# EAGLE design doska-analog (EAGLE 6.3)
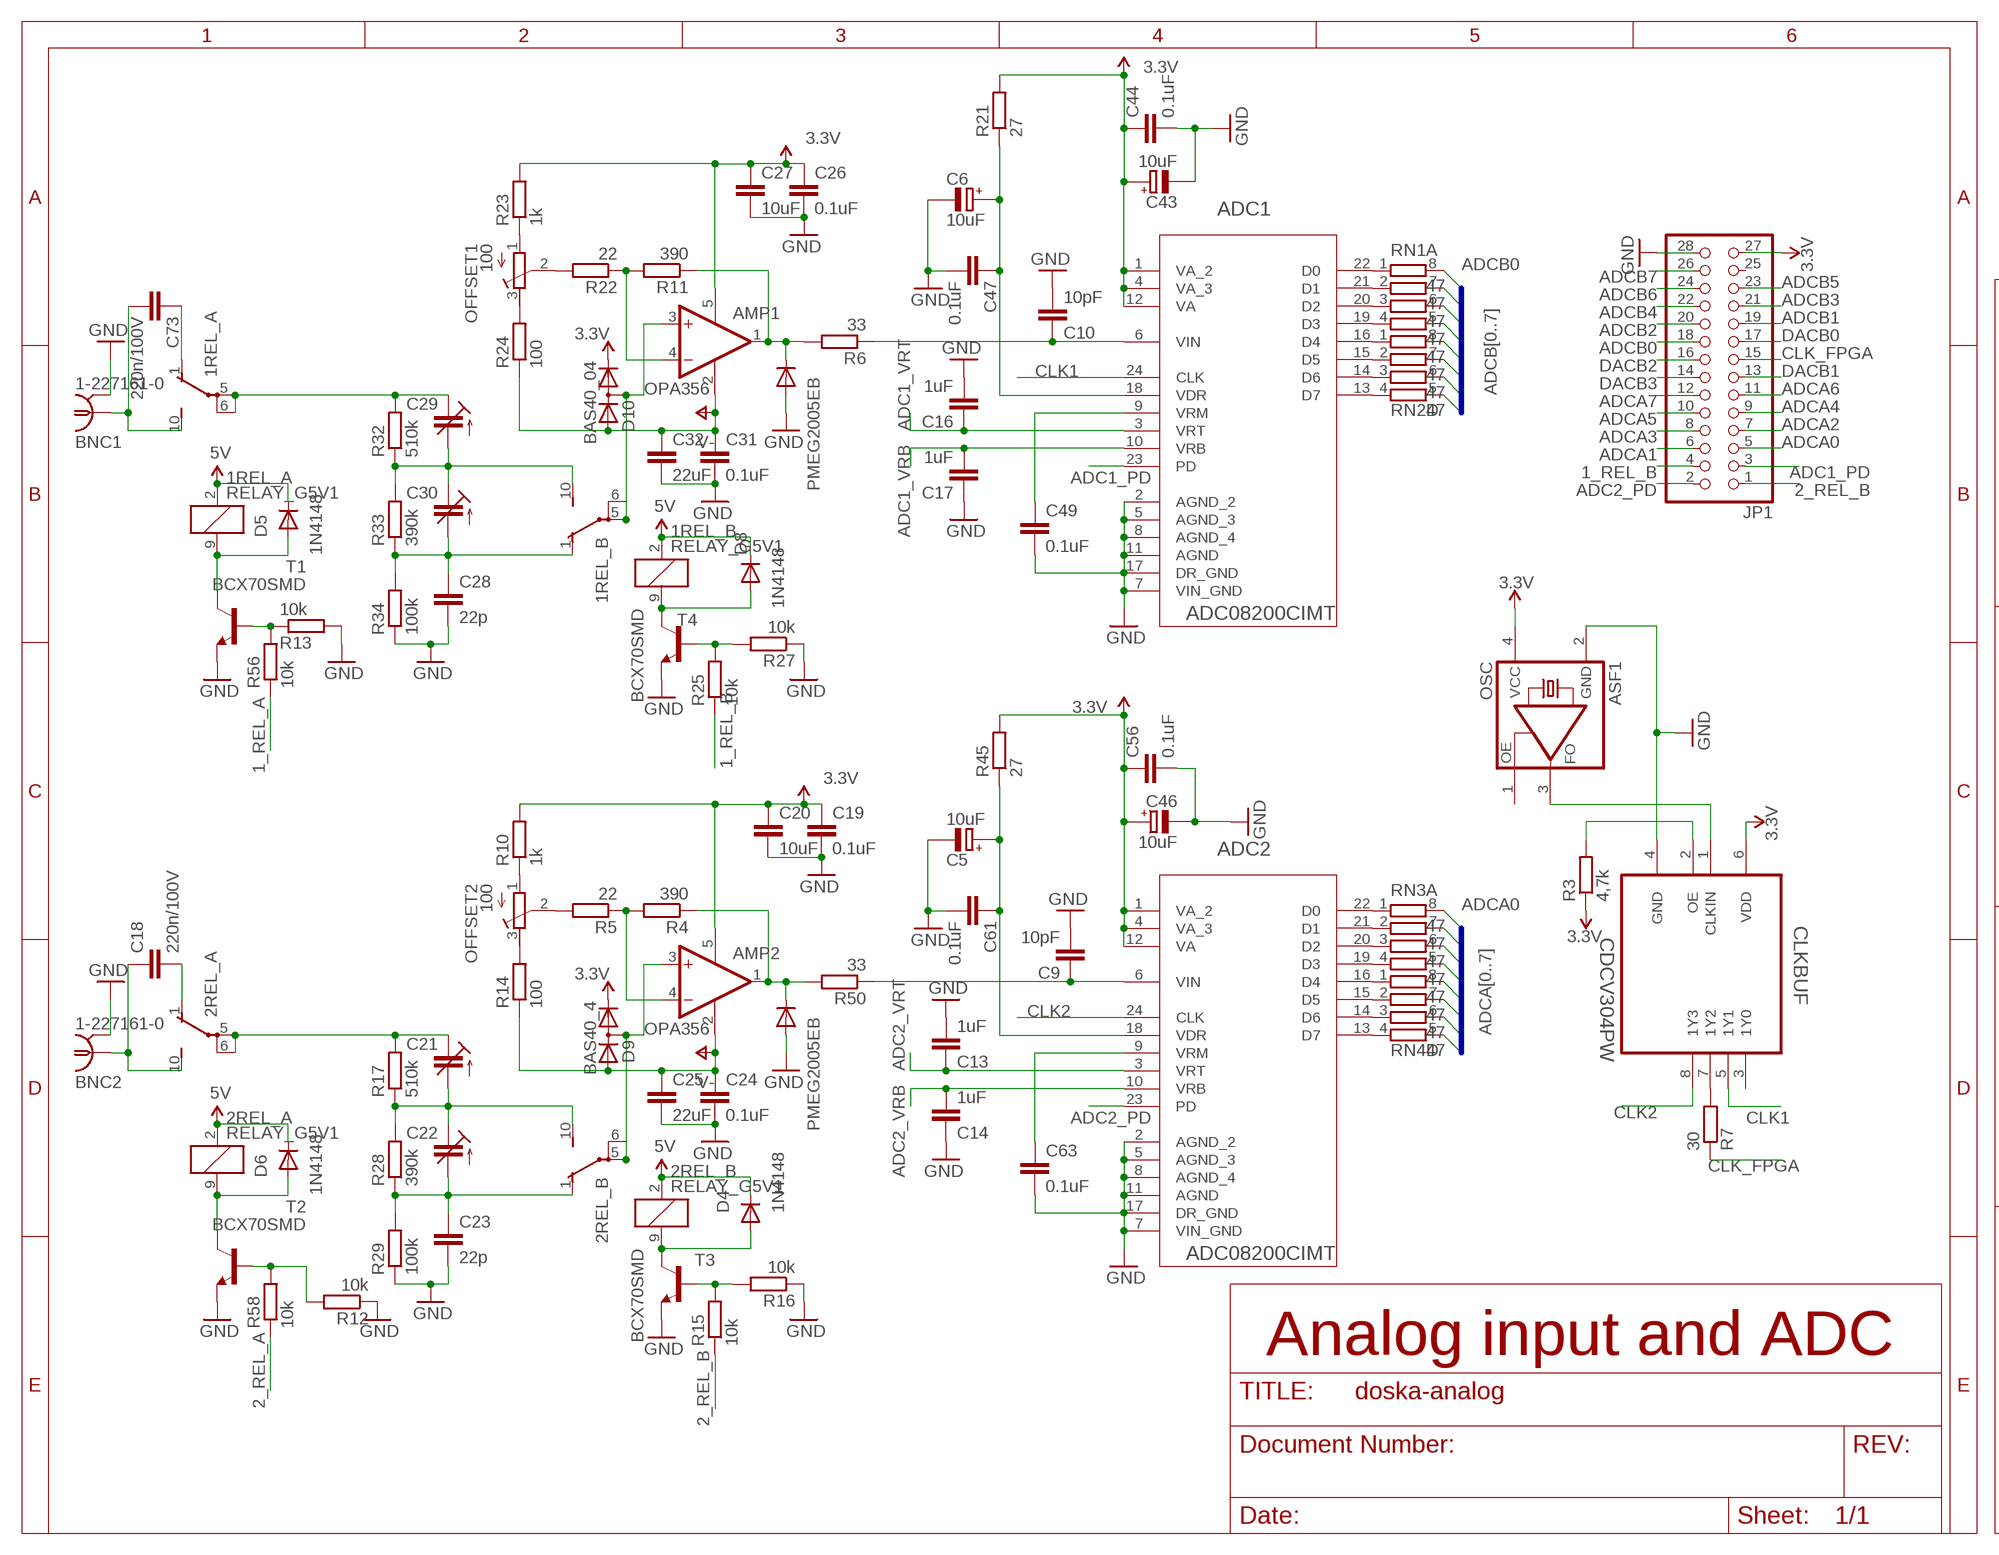
[diagram p0: schematic, sheet 1, part 1 of 2]
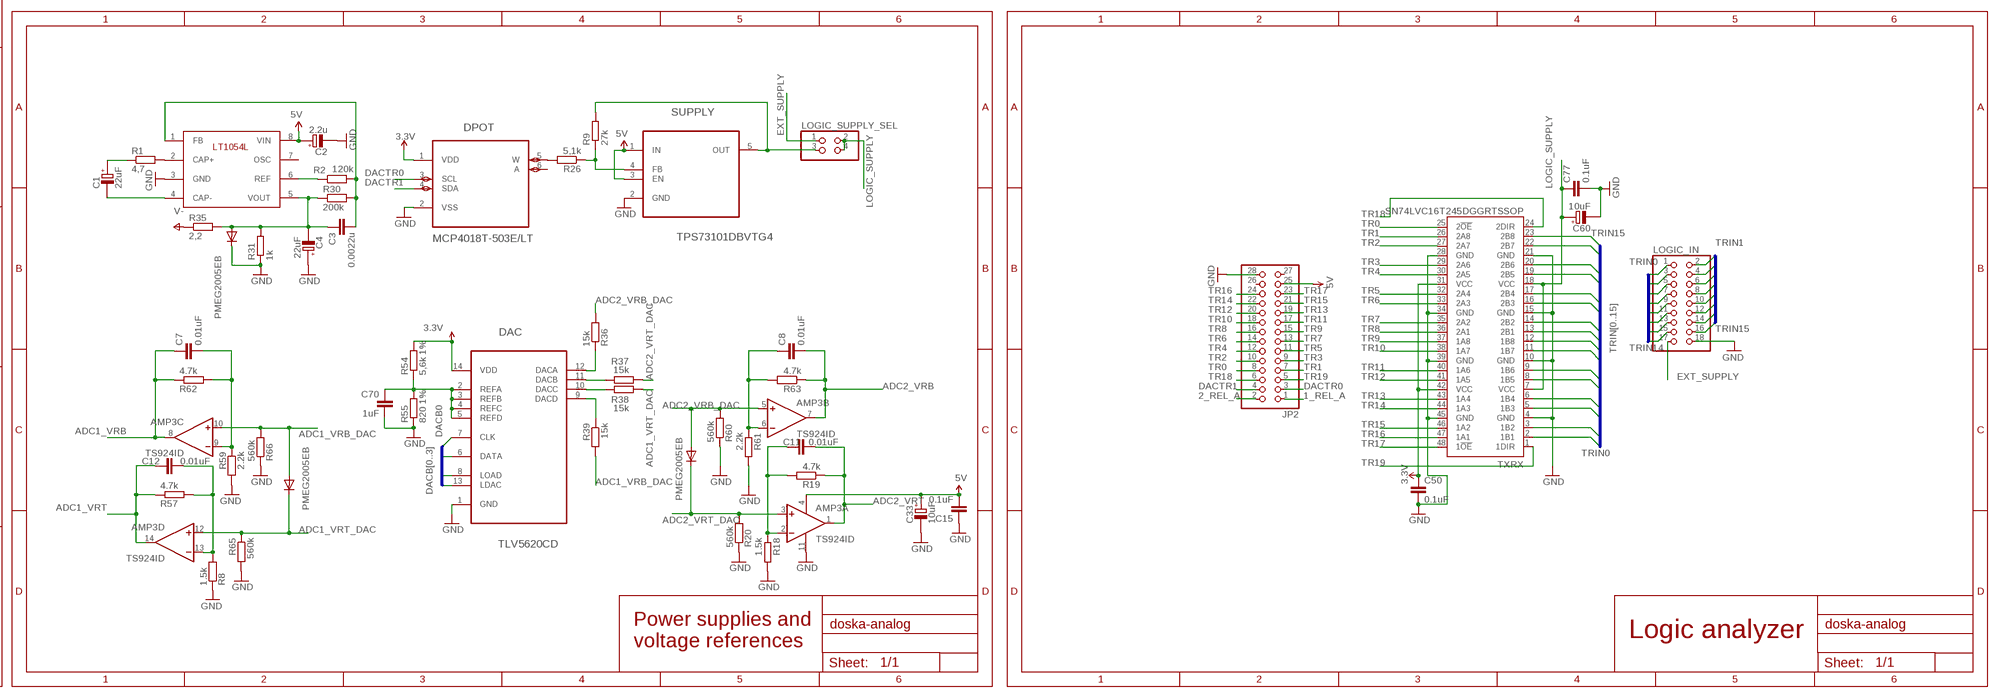
[diagram p1: schematic, sheet 1, part 2 of 2]

## Parts
1REL_A  RELAY_G5V1  [RELAY_G5V1]
1REL_B  RELAY_G5V1  [RELAY_G5V1]
2REL_A  RELAY_G5V1  [RELAY_G5V1]
2REL_B  RELAY_G5V1  [RELAY_G5V1]
ADC1  ADC08200CIMT  [SOP65P640X110-24N]
ADC2  ADC08200CIMT  [SOP65P640X110-24N]
AMP1  OPA356  [SOT23-5]
AMP2  OPA356  [SOT23-5]
AMP3  TS924ID  LM324  [SOIC127P600X175-14N]
BNC1  1-227161-0  [AMP_227161]
BNC2  1-227161-0  [AMP_227161]
C1  22uF  POLARISED_B_CASE  [CAPMP3528X210N]
C2  2.2u  POLARISED_A_CASE  [CAPMP3216X180N]
C3  0.0022u  CAPC603  [C603]
C4  22uF  POLARISED_B_CASE  [CAPMP3528X210N]
C5  10uF  POLARISED_A_CASE  [CAPMP3216X180N]
C6  10uF  POLARISED_A_CASE  [CAPMP3216X180N]
C7  0.01uF  CAPC603  [C603]
C8  0.01uF  CAPC603  [C603]
C9  10pF  CAPC603  [C603]
C10  10pF  CAPC603  [C603]
C11  0.01uF  CAPC603  [C603]
C12  0.01uF  CAPC603  [C603]
C13  1uF  CAPC603  [C603]
C14  1uF  CAPC603  [C603]
C15  0.1uF  CAPC805  [C805]
C16  1uF  CAPC603  [C603]
C17  1uF  CAPC603  [C603]
C18  220n/100V  CAPC1206  [C1206]
C19  0.1uF  CAPC603  [C603]
C20  10uF  CAPC805  [C805]
C21  TZB4Z100AB10R00  C-TRIMMTZB4  [CTRIMTZB4]
C22  TZB4Z100AB10R00  C-TRIMMTZB4  [CTRIMTZB4]
C23  22p  CAPC603  [C603]
C24  0.1uF  CAPC603  [C603]
C25  22uF  CAPC805  [C805]
C26  0.1uF  CAPC603  [C603]
C27  10uF  CAPC805  [C805]
C28  22p  CAPC603  [C603]
C29  TZB4Z100AB10R00  C-TRIMMTZB4  [CTRIMTZB4]
C30  TZB4Z100AB10R00  C-TRIMMTZB4  [CTRIMTZB4]
C31  0.1uF  CAPC603  [C603]
C32  22uF  CAPC805  [C805]
C33  10uF  POLARISED_A_CASE  [CAPMP3216X180N]
C43  10uF  POLARISED_A_CASE  [CAPMP3216X180N]
C44  0.1uF  CAPC603  [C603]
C46  10uF  POLARISED_A_CASE  [CAPMP3216X180N]
C47  0.1uF  CAPC603  [C603]
C49  0.1uF  CAPC603  [C603]
C50  0.1uF  CAPC805  [C805]
C56  0.1uF  CAPC603  [C603]
C60  10uF  POLARISED_A_CASE  [CAPMP3216X180N]
C61  0.1uF  CAPC603  [C603]
C63  0.1uF  CAPC603  [C603]
C70  1uF  CAPC603  [C603]
C73  220n/100V  CAPC1206  [C1206]
C77  0.1uF  CAPC805  [C805]
CLKBUF  CDCV304PW  [SOP65P640X120-8N]
D1  PMEG2005EB  DIODE-SOD523  [SOD523]
D2  PMEG2005EB  DIODE-SOD523  [SOD523]
D3  PMEG2005EB  DIODE-SOD523  [SOD523]
D4  1N4148  DIODE-SOD323-R  [SOD323-R]
D5  1N4148  DIODE-SOD323-R  [SOD323-R]
D6  1N4148  DIODE-SOD323-R  [SOD323-R]
D7  PMEG2005EB  DIODE-SOD523  [SOD523]
D8  1N4148  DIODE-SOD323-R  [SOD323-R]
D9  BAS40_4  DIODE_2CACA-SOT23  [SOT23]
D10  BAS40_04  DIODE_2CACA-SOT23  [SOT23]
D11  PMEG2005EB  DIODE-SOD523  [SOD523]
DAC  TLV5620CD  [SOIC127P600X175-14N]
DPOT  MCP4018T-503E/LT  [SOT65P210X110-6N]
JP1  PINHEAD_PINHD-2X14  [PINHEAD_2X14]
JP2  PINHEAD_PINHD-2X14  [PINHEAD_2X14]
LOGIC_IN  PINHEAD_PINHD-2X9  [PINHEAD_2X09]
LOGIC_SUPPLY_SEL  PINHEAD_PINHD-2X2  [PINHEAD_2X02]
OFFSET1  100  R-TRIMMTC33  [RTRIMTC33]
OFFSET2  100  R-TRIMMTC33  [RTRIMTC33]
OSC  ASF1  [ASF]
R1  4,7  RESISTORR1206  [R1206]
R2  120k  RESISTORR603  [R603]
R3  4,7k  RESISTORR603  [R603]
R4  390  RESISTORR603  [R603]
R5  22  RESISTORR603  [R603]
R6  33  RESISTORR603  [R603]
R7  30  RESISTORR603  [R603]
R8  1.5k  RESISTORR603  [R603]
R9  27k  RESISTORR603  [R603]
R10  1k  RESISTORR603  [R603]
R11  390  RESISTORR603  [R603]
R12  10k  RESISTORR603  [R603]
R13  10k  RESISTORR603  [R603]
R14  100  RESISTORR603  [R603]
R15  10k  RESISTORR603  [R603]
R16  10k  RESISTORR603  [R603]
R17  510k  RESISTORR805R805  [R805]
R18  1.5k  RESISTORR603  [R603]
R19  4.7k  RESISTORR603  [R603]
R20  560k  RESISTORR603  [R603]
R21  27  RESISTORR603  [R603]
R22  22  RESISTORR603  [R603]
R23  1k  RESISTORR603  [R603]
R24  100  RESISTORR603  [R603]
R25  10k  RESISTORR603  [R603]
R26  5,1k  RESISTORR603  [R603]
R27  10k  RESISTORR603  [R603]
R28  390k  RESISTORR805R805  [R805]
R29  100k  RESISTORR805R805  [R805]
R30  200k  RESISTORR603  [R603]
R31  1k  RESISTORR603  [R603]
R32  510k  RESISTORR805R805  [R805]
R33  390k  RESISTORR805R805  [R805]
R34  100k  RESISTORR805R805  [R805]
R35  2,2  RESISTORR603  [R603]
R36  15k  RESISTORR603  [R603]
R37  15k  RESISTORR603  [R603]
R38  15k  RESISTORR603  [R603]
R39  15k  RESISTORR603  [R603]
R45  27  RESISTORR603  [R603]
R50  33  RESISTORR603  [R603]
R54  5,6k 1%  RESISTORR603  [R603]
R55  820 1%  RESISTORR603  [R603]
R56  10k  RESISTORR603  [R603]
R57  4.7k  RESISTORR603  [R603]
R58  10k  RESISTORR603  [R603]
R59  2.2k  RESISTORR603  [R603]
R60  560k  RESISTORR603  [R603]
R61  2.2k  RESISTORR603  [R603]
R62  4.7k  RESISTORR603  [R603]
R63  4.7k  RESISTORR603  [R603]
R65  560k  RESISTORR603  [R603]
R66  560k  RESISTORR603  [R603]
RN1  47  4R-NEXB38V  [EXB38V]
RN2  47  4R-NEXB38V  [EXB38V]
RN3  47  4R-NEXB38V  [EXB38V]
RN4  47  4R-NEXB38V  [EXB38V]
SUPPLY  TPS73101DBVTG4  [SOT95P280X145-5N]
T1  BCX70SMD  [SOT23]
T2  BCX70SMD  [SOT23]
T3  BCX70SMD  [SOT23]
T4  BCX70SMD  [SOT23]
TXRX  SN74LVC16T245DGGRTSSOP  [TSSOP48]
VREG  LT1054LCS8  [SO08]

## Nets
1_REL_A: JP2.1 R56.1
1_REL_B: JP1.4 R25.1
2_REL_A: JP2.2 R58.1
2_REL_B: JP1.1 R15.1
3.3V: ADC1.1(VA_2) ADC1.4(VA_3) ADC1.12(VA) ADC2.1(VA_2) ADC2.4(VA_3) ADC2.12(VA) AMP1.5(V+) AMP2.5(V+) C19.1 C20.1 C26.1 C27.1 C43.+ C44.1 C46.+ C50.1 C56.1 CLKBUF.6(VDD) D9.2(C) D10.2(C) DAC.14(VDD) DPOT.1(VDD) JP1.27 OSC.4(VCC) R3.1 R10.2 R21.2 R23.2 R45.2 R54.2 TXRX.31(VCC) TXRX.42(VCC)
5V: 1REL_A.2 1REL_B.2 2REL_A.2 2REL_B.2 AMP3.4(P:V+) C2.+ C15.2 C33.+ D4.C D5.C D6.C D8.C JP2.25 SUPPLY.1(IN) SUPPLY.3(EN) VREG.8(VIN)
ADC1_PD: ADC1.23(PD) JP1.3
ADC1_VRB: ADC1.10(VRB) AMP3.8(C:OUT) C7.1 C17.2 R62.1
ADC1_VRB_DAC: AMP3.10(C:+IN) D2.A R39.2 R66.2
ADC1_VRB_DAC_OUT: DAC.9(DACD) R39.1
ADC1_VRT: ADC1.3(VRT) AMP3.14(D:OUT) C12.1 C16.1 R57.1
ADC1_VRT_DAC: AMP3.12(D:+IN) D2.C R38.1 R65.1
ADC1_VRT_DAC_OUT: DAC.10(DACC) R38.2
ADC2_PD: ADC2.23(PD) JP1.2
ADC2_VRB: ADC2.10(VRB) AMP3.7(B:OUT) C8.2 C14.2 R63.1
ADC2_VRB_DAC: AMP3.5(B:+IN) D3.A R36.2 R60.2
ADC2_VRB_DAC_OUT: DAC.12(DACA) R36.1
ADC2_VRT: ADC2.3(VRT) AMP3.1(A:OUT) C11.2 C13.1 R19.1
ADC2_VRT_DAC: AMP3.3(A:+IN) D3.C R20.2 R37.1
ADC2_VRT_DAC_OUT: DAC.11(DACB) R37.2
ADCA0: JP1.5 RN3.8
ADCA1: JP1.6 RN3.7
ADCA2: JP1.7 RN3.6
ADCA3: JP1.8 RN3.5
ADCA4: JP1.9 RN4.8
ADCA5: JP1.10 RN4.7
ADCA6: JP1.11 RN4.6
ADCA7: JP1.12 RN4.5
ADCB0: JP1.18 RN1.8
ADCB1: JP1.19 RN1.7
ADCB2: JP1.20 RN1.6
ADCB3: JP1.21 RN1.5
ADCB4: JP1.22 RN2.8
ADCB5: JP1.23 RN2.7
ADCB6: JP1.24 RN2.6
ADCB7: JP1.26 RN2.5
CLK1: ADC1.24(CLK) CLKBUF.5(1Y1)
CLK2: ADC2.24(CLK) CLKBUF.8(1Y3)
CLK_FPGA: JP1.15 R7.1
DACB0: DAC.7(CLK) JP1.17
DACB1: DAC.6(DATA) JP1.13
DACB2: DAC.8(LOAD) JP1.16
DACB3: DAC.13(LDAC) JP1.14
DACTR0: DPOT.3(SCL) JP2.3
DACTR1: DPOT.4(SDA) JP2.4
EXT_SUPPLY: LOGIC_IN.17 LOGIC_SUPPLY_SEL.1
GND: ADC1.2(AGND_2) ADC1.5(AGND_3) ADC1.7(VIN_GND) ADC1.8(AGND_4) ADC1.11(AGND) ADC1.17(DR_GND) ADC2.2(AGND_2) ADC2.5(AGND_3) ADC2.7(VIN_GND) ADC2.8(AGND_4) ADC2.11(AGND) ADC2.17(DR_GND) AMP3.11(P:V-) BNC1.2(GND) BNC2.2(GND) C2.- C4.+ C5.- C6.- C9.2 C10.2 C13.2 C14.1 C15.1 C16.2 C17.1 C19.2 C20.2 C23.2 C24.2 C25.2 C26.2 C27.2 C28.2 C31.2 C32.2 C33.- C43.- C44.2 C46.- C47.2 C49.2 C50.2 C56.2 C60.- C61.2 C63.2 C70.2 C77.2 CLKBUF.4(GND) D1.A D7.A D11.C DAC.1(GND) DPOT.2(VSS) JP1.28 JP2.28 LOGIC_IN.18 OSC.2(GND) R8.1 R12.1 R13.2 R16.1 R18.2 R20.1 R27.1 R29.1 R31.1 R34.1 R55.1 R59.2 R60.1 R61.2 R65.2 R66.1 SUPPLY.2(GND) T1.2(E) T2.2(E) T3.2(E) T4.2(E) TXRX.4(GND) TXRX.10(GND) TXRX.15(GND) TXRX.21(GND) TXRX.28(GND) TXRX.34(GND) TXRX.39(GND) TXRX.45(GND) VREG.3(GND)
HF_IN: 1REL_A.5(2:P) 1REL_A.6(2:P) C29.1(E) R32.2
HF_IN1: 2REL_A.5(2:P) 2REL_A.6(2:P) C21.1(E) R17.2
LOGIC_SUPPLY: C60.+ C77.1 LOGIC_SUPPLY_SEL.2 LOGIC_SUPPLY_SEL.4 TXRX.7(VCC) TXRX.18(VCC)
N$2: R1.2 VREG.2(CAP+)
N$3: OFFSET1.2(S) R22.2
N$4: CLKBUF.2(OE) R3.2
N$5: C1.- VREG.4(CAP-)
N$6: CLKBUF.1(CLKIN) OSC.3(FO)
N$7: 2REL_A.1(2:O) C18.2
N$8: AMP2.1(OUT) D7.C R4.1 R50.2
N$9: C1.+ R1.1
N$10: CLKBUF.7(1Y2) R7.2
N$11: OFFSET1.1(E) R23.1
N$12: OFFSET1.3(A) R24.2
N$13: AMP1.1(OUT) D1.C R6.2 R11.1
N$14: AMP1.4(-IN) R11.2 R22.1
N$15: R9.1 R26.1 SUPPLY.4(FB)
N$16: DPOT.5(W) R26.2
N$17: LOGIC_SUPPLY_SEL.3 R9.2 SUPPLY.5(OUT)
N$18: AMP3.9(C:-IN) C7.2 R59.1 R62.2
N$19: R15.2 R16.2 T3.1(B)
N$20: OFFSET2.2(S) R5.2
N$21: AMP2.4(-IN) R4.2 R5.1
N$22: OFFSET2.1(E) R10.1
N$23: ADC1.9(VRM) C49.1
N$24: ADC1.6(VIN) C10.1 R6.1
N$25: OFFSET2.3(A) R14.2
N$26: AMP3.13(D:-IN) C12.2 R8.2 R57.2
N$27: 2REL_B.10(2:S) C21.2(A) C22.1(E) R17.1 R28.2
N$28: ADC1.18(VDR) C6.+ C47.1 R21.1
N$29: 1REL_B.10(2:S) C29.2(A) C30.1(E) R32.1 R33.2
N$32: 1REL_B.5(2:P) 1REL_B.6(2:P) AMP1.3(+IN) D10.3(AC)
N$33: 1REL_B.9 D8.A T4.3(C)
N$34: R25.2 R27.2 T4.1(B)
N$39: 1REL_A.1(2:O) C73.1
N$41: 2REL_B.5(2:P) 2REL_B.6(2:P) AMP2.3(+IN) D9.3(AC)
N$42: R2.1 VREG.6(REF)
N$43: 2REL_B.9 D4.A T3.3(C)
N$44: C3.1 C4.- D11.A R30.1 R31.2 R35.2 VREG.5(VOUT)
N$46: 2REL_B.1(2:O) C22.2(A) C23.1 R28.1 R29.2
N$47: C3.2 R2.2 R30.2 VREG.1(FB)
N$49: 1REL_B.1(2:O) C28.1 C30.2(A) R33.1 R34.2
N$51: ADC1.22(D0) RN1.1
N$52: ADC1.21(D1) RN1.2
N$53: ADC1.20(D2) RN1.3
N$54: ADC2.9(VRM) C63.1
N$55: ADC2.6(VIN) C9.1 R50.1
N$56: ADC2.18(VDR) C5.+ C61.1 R45.1
N$57: ADC1.19(D3) RN1.4
N$58: ADC1.16(D4) RN2.1
N$59: ADC1.15(D5) RN2.2
N$60: ADC1.14(D6) RN2.3
N$61: ADC1.13(D7) RN2.4
N$62: ADC2.22(D0) RN3.1
N$63: ADC2.21(D1) RN3.2
N$64: C70.1 DAC.2(REFA) DAC.3(REFB) DAC.4(REFC) DAC.5(REFD) R54.1 R55.2
N$65: ADC2.20(D2) RN3.3
N$66: ADC2.19(D3) RN3.4
N$67: AMP3.2(A:-IN) C11.1 R18.1 R19.2
N$69: ADC2.16(D4) RN4.1
N$72: ADC2.15(D5) RN4.2
N$73: 1REL_A.10(2:S) BNC1.1 C73.2
N$75: AMP3.6(B:-IN) C8.1 R61.1 R63.2
N$76: ADC2.14(D6) RN4.3
N$77: ADC2.13(D7) RN4.4
N$78: 1REL_A.9 D5.A T1.3(C)
N$80: R13.1 R56.2 T1.1(B)
N$81: 2REL_A.10(2:S) BNC2.1 C18.1
N$84: 2REL_A.9 D6.A T2.3(C)
N$85: R12.2 R58.2 T2.1(B)
TR0: JP2.8 TXRX.25(2!OE)
TR1: JP2.7 TXRX.26(2A8)
TR2: JP2.10 TXRX.27(2A7)
TR3: JP2.9 TXRX.29(2A6)
TR4: JP2.12 TXRX.30(2A5)
TR5: JP2.11 TXRX.32(2A4)
TR6: JP2.14 TXRX.33(2A3)
TR7: JP2.13 TXRX.35(2A2)
TR8: JP2.16 TXRX.36(2A1)
TR9: JP2.15 TXRX.37(1A8)
TR10: JP2.18 TXRX.38(1A7)
TR11: JP2.17 TXRX.40(1A6)
TR12: JP2.20 TXRX.41(1A5)
TR13: JP2.19 TXRX.43(1A4)
TR14: JP2.22 TXRX.44(1A3)
TR15: JP2.21 TXRX.46(1A2)
TR16: JP2.24 TXRX.47(1A1)
TR17: JP2.23 TXRX.48(1!OE)
TR18: JP2.6 TXRX.24(2DIR)
TR19: JP2.5 TXRX.1(1DIR)
TRIN0: LOGIC_IN.1 TXRX.2(1B1)
TRIN1: LOGIC_IN.2 TXRX.3(1B2)
TRIN2: LOGIC_IN.3 TXRX.5(1B3)
TRIN3: LOGIC_IN.4 TXRX.6(1B4)
TRIN4: LOGIC_IN.5 TXRX.8(1B5)
TRIN5: LOGIC_IN.6 TXRX.9(1B6)
TRIN6: LOGIC_IN.7 TXRX.11(1B7)
TRIN7: LOGIC_IN.8 TXRX.12(1B8)
TRIN8: LOGIC_IN.9 TXRX.13(2B1)
TRIN9: LOGIC_IN.10 TXRX.14(2B2)
TRIN10: LOGIC_IN.11 TXRX.16(2B3)
TRIN11: LOGIC_IN.12 TXRX.17(2B4)
TRIN12: LOGIC_IN.13 TXRX.19(2B5)
TRIN13: LOGIC_IN.14 TXRX.20(2B6)
TRIN14: LOGIC_IN.15 TXRX.22(2B7)
TRIN15: LOGIC_IN.16 TXRX.23(2B8)
V-: AMP1.2(V-) AMP2.2(V-) C24.1 C25.1 C31.1 C32.1 D9.1(A) D10.1(A) R14.1 R24.1 R35.1
Unconnected: CLKBUF.3(1Y0) DPOT.6(A) JP1.25 JP2.26 JP2.27 OSC.1(OE) VREG.7(OSC)

## Buses
TRIN[0..15]
ADCA[0..7]
ADCB[0..7]
DACB[0..3]

## Notes on the sheet
- Analog input and ADC
- Logic analyzer
- Power supplies and 
  voltage references

## Library data of the parts
1REL_A 1REL_B 2REL_A 2REL_B = doska-analog:RELAY_G5V1: RELAY 1 x switch, 0.5 A/125 V AC, 1 A/24 V DC , Omron; MPN: G5V-1-DC24; OC_FARNELL: 9949593; OC_NEWARK: 36M6377
ADC1 ADC2 = ADC08200CIMT:ADC08200CIMT: A/D Converter; MPN: ADC08200CIMT; OC_FARNELL: 8206805; OC_NEWARK: -; PACKAGE: 24-TSSOP; SUPPLIER: NATIONAL SEMICONDUCTOR
AMP1 AMP2 = linear:OPA356
AMP3 = linear:LM324: OP AMP
BNC1 BNC2 = con-coax:?227161*: JACK, RIGHT ANGLE, 50 OHM, PCB, BNC Source: amp_227161.pdf; MF: TYCO ELECTRONICS; MPN: 1-227161; OC_FARNELL: unknown; OC_NEWARK: 33B3200
C1 C2 C4-C6 C33 C43 C46 C60 = ipc-7351-capacitor:POLARISED_
C3 C7-C20 C23-C28 C31 C32 C44 C47 C49 C50 C56 C61 C63 C70 C73 C77 = dp_devices:CAP
C21 C22 C29 C30 = resistor:C-TRIMM: Trimm capacitor
CLKBUF = buffer:CDCV304PW: 200MHZ GENERAL PURPOSE CLOCK BUFFER; MPN: CDCV304PW; OC_FARNELL: 8408335; OC_NEWARK: 34K2396; PACKAGE: TSSOP-8; SUPPLIER: Texas Instruments
D1-D8 D11 = diode:DIODE-: DIODE
D9 D10 = diode:DIODE_2CACA-: 2 Diodes - Cathode-Anode|Cathode-Anode
DAC = TLV5620CD:TLV5620CD: QUADRUPLE 8-BIT DIGITAL-TO-ANALOG CONVERTERS; MPN: TLV5620CD; OC_FARNELL: 8455694; OC_NEWARK: 35K1252; PACKAGE: SOIC-14; SUPPLIER: Texas Instruments
DPOT = variable-supply:MCP4018T-503E/LT: Digital POT; MPN: MCP4018T-503E/LT; OC_FARNELL: 1825019; OC_NEWARK: 08R1803; PACKAGE: SOT-6; SUPPLIER: Microchip
JP1 JP2 = doska-analog:PINHEAD_PINHD-2X14: PIN HEADER
LOGIC_IN = doska-analog:PINHEAD_PINHD-2X9: PIN HEADER
LOGIC_SUPPLY_SEL = doska-analog:PINHEAD_PINHD-2X2: PIN HEADER
OFFSET1 OFFSET2 = resistor:R-TRIMM: Trimm resistor
OSC = crystal:ASF*: CRYSTAL CLOCK OSCILLATORS 5.0 Vdc or 3.3 Vdc - LOW PROFILE ULTRA MINIATURE CERAMIC SURFACE MOUNT Source: http://www.abracon.com/Oscillators/asf1-L-L1.pdf; OC_FARNELL: unknown; OC_NEWARK: unknown
R1-R39 R45 R50 R54-R63 R65 R66 = dp_devices:RESISTOR
RN1-RN4 = resistor-dil:4R-N: Array Chip Resistor Source: RS Component / Phycomp; OC_FARNELL: unknown; OC_NEWARK: unknown
SUPPLY = variable-supply:TPS73101DBVTG4: Low Dropout Regulator; MPN: TPS73101DBVTG4; OC_FARNELL: 1207340; OC_NEWARK: 62M0773; PACKAGE: SOT-23-5; SUPPLIER: Texas Instruments
T1-T4 = transistor:BCX70SMD: NPN TRANSISTOR
TXRX = texas:SN74LVC16T245DGGR
VREG = linear:LT1054LCS8

## Board
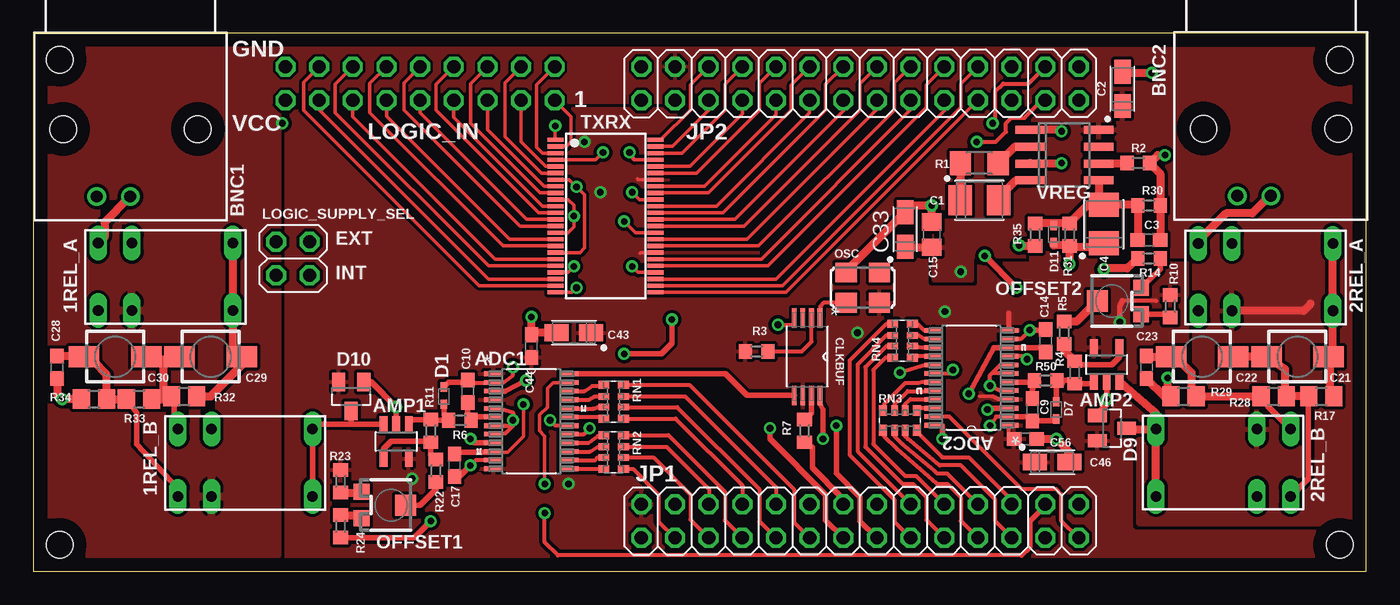
[diagram p2: board, top side]
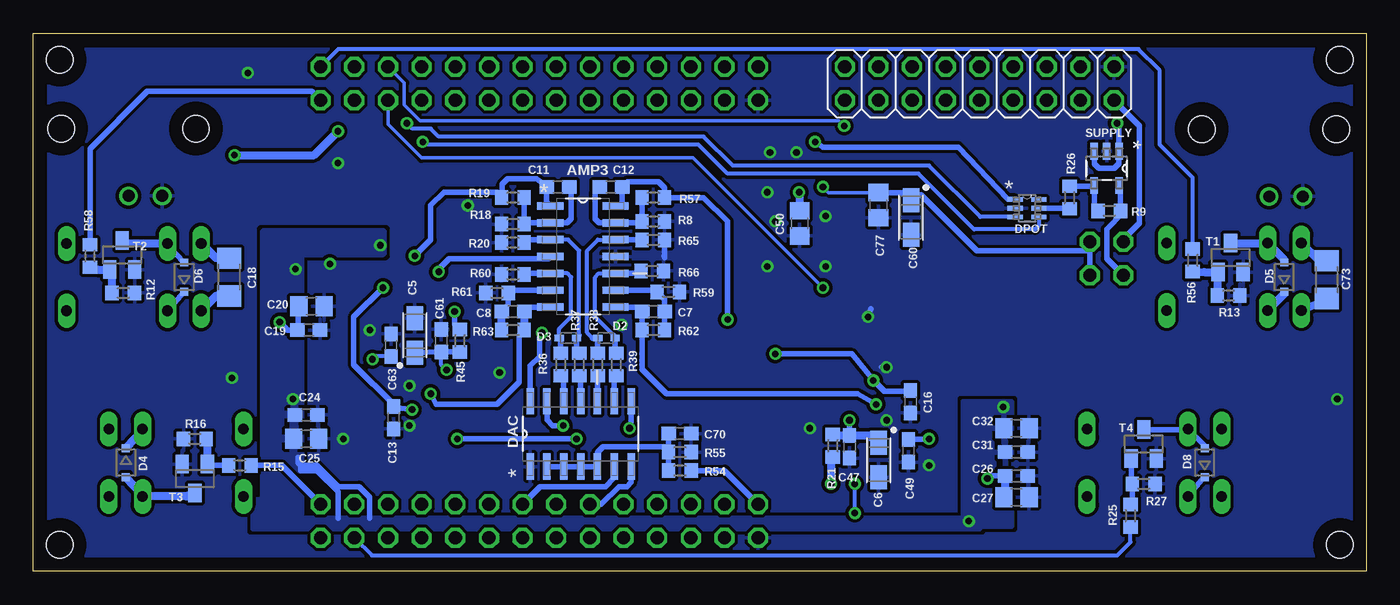
[diagram p3: board, bottom side, seen from below]

Size 100.6 x 40.6 mm. Coordinates in mm from the lower left corner, seen from the top.
Outline: 0,0 100.6,0 100.6,40.6 0,40.6 0,0
Copper layers (1*16): Top 0.035mm / dielectric 1.5mm / Bottom 0.035mm
Design rules "default *": minimum track width 10mil, minimum drill 0.5mm, track to track 8mil, track to pad 8mil, pad to pad 7mil, via to via 8mil, smd to smd 4mil, copper to edge 40mil, drill to drill 8mil, minimum pad ring 10mil, minimum via ring 8mil, stop-mask expansion 4mil, vias tented up to drill 0.5mm, thermal gap 10mil
Holes 2 mm at 2,2 98.6,2 2,38.6 98.6,38.6

### Footprints (pad centres in the part's own frame; a part is rotated, then mirrored left to right if it is on the bottom)
RELAY_G5V1 = drill 0.8 long: 1 -5.08,-2.54; 2 -2.54,-2.54; 5 5.08,-2.54; 6 5.08,2.54; 9 -2.54,2.54; 10 -5.08,2.54
SOP65P640X110-24N = smd 1.422 x 0.356: 1 -2.845,3.581; 2 -2.845,2.921; 3 -2.845,2.286; 4 -2.845,1.626; 5 -2.845,0.965; 6 -2.845,0.33; 7 -2.845,-0.33; 8 -2.845,-0.965; 9 -2.845,-1.626; 10 -2.845,-2.286; 11 -2.845,-2.921; 12 -2.845,-3.581; 13 2.845,-3.581; 14 2.845,-2.921; 15 2.845,-2.286; 16 2.845,-1.626; 17 2.845,-0.965; 18 2.845,-0.33; 19 2.845,0.33; 20 2.845,0.965; 21 2.845,1.626; 22 2.845,2.286; 23 2.845,2.921; 24 2.845,3.581
SOT23-5 = smd 0.6 x 1.2: 1 -0.95,-1.306; 2 0,-1.306; 3 0.95,-1.306; 4 0.95,1.306; 5 -0.95,1.306
SOIC127P600X175-14N = smd 1.981 x 0.559: 1 -2.464,3.81; 2 -2.464,2.54; 3 -2.464,1.27; 4 -2.464,0; 5 -2.464,-1.27; 6 -2.464,-2.54; 7 -2.464,-3.81; 8 2.464,-3.81; 9 2.464,-2.54; 10 2.464,-1.27; 11 2.464,0; 12 2.464,1.27; 13 2.464,2.54; 14 2.464,3.81
AMP_227161 = drill 0.9 pad 1.27: 1 0,-5.08; 2 -2.54,-5.08 | hole 2: -5.08,0; 5.08,0
CAPMP3528X210N = smd 1.8 x 2.25: + -1.45,0; - 1.45,0
CAPMP3216X180N = smd 1.8 x 1.25: + -1.3,0; - 1.3,0
C603 = smd 1.1 x 1: 1 -0.85,0; 2 0.85,0
C805 = smd 1.3 x 1.5: 1 -0.95,0; 2 0.95,0
C1206 = smd 1.6 x 1.803: 1 -1.422,0; 2 1.422,0
CTRIMTZB4 = smd 1.6 x 2.3: 1 0,2.35; 2 0,-2.35
SOP65P640X120-8N = smd 1.473 x 0.356: 1 -2.921,0.965; 2 -2.921,0.33; 3 -2.921,-0.33; 4 -2.921,-0.965; 5 2.921,-0.965; 6 2.921,-0.33; 7 2.921,0.33; 8 2.921,0.965
SOD523 = smd 0.7 x 0.5: A 0.7,0; C -0.6,0
SOD323-R = smd 0.6 x 0.6: A 1.1,0; C -1.1,0
SOT23 = smd 1 x 1.4: 1 -0.95,-1.1; 2 0.95,-1.1; 3 0,1.1
SOT65P210X110-6N = smd 1.168 x 0.356: 1 -0.889,0.66; 2 -0.889,0; 3 -0.889,-0.66; 4 0.889,-0.66; 5 0.889,0; 6 0.889,0.66
PINHEAD_2X14 = drill 1 octagon: 1 -16.51,-1.27; 2 -16.51,1.27; 3 -13.97,-1.27; 4 -13.97,1.27; 5 -11.43,-1.27; 6 -11.43,1.27; 7 -8.89,-1.27; 8 -8.89,1.27; 9 -6.35,-1.27; 10 -6.35,1.27; 11 -3.81,-1.27; 12 -3.81,1.27; 13 -1.27,-1.27; 14 -1.27,1.27; 15 1.27,-1.27; 16 1.27,1.27; 17 3.81,-1.27; 18 3.81,1.27; 19 6.35,-1.27; 20 6.35,1.27; 21 8.89,-1.27; 22 8.89,1.27; 23 11.43,-1.27; 24 11.43,1.27; 25 13.97,-1.27; 26 13.97,1.27; 27 16.51,-1.27; 28 16.51,1.27
PINHEAD_2X09 = drill 1 octagon: 1 -10.16,-1.27; 2 -10.16,1.27; 3 -7.62,-1.27; 4 -7.62,1.27; 5 -5.08,-1.27; 6 -5.08,1.27; 7 -2.54,-1.27; 8 -2.54,1.27; 9 0,-1.27; 10 0,1.27; 11 2.54,-1.27; 12 2.54,1.27; 13 5.08,-1.27; 14 5.08,1.27; 15 7.62,-1.27; 16 7.62,1.27; 17 10.16,-1.27; 18 10.16,1.27
PINHEAD_2X02 = drill 1 octagon: 1 -1.27,-1.27; 2 -1.27,1.27; 3 1.27,-1.27; 4 1.27,1.27
RTRIMTC33 = smd 1.2 x 1.2: 1 -1,-1.8; 3 1,-1.8 | smd 1.6 x 1.6: 2 0,1.5
ASF = smd 1.6 x 1.5: 1 -1.25,-1.15; 2 1.25,-1.15; 3 1.25,1.15; 4 -1.25,1.15
R1206 = smd 1.6 x 1.803: 1 -1.422,0; 2 1.422,0
R603 = smd 1 x 1.1: 1 -0.85,0; 2 0.85,0
R805 = smd 1.3 x 1.5: 1 -0.95,0; 2 0.95,0
EXB38V = smd 0.6 x 0.8: 1 -1.275,-0.75; 4 1.275,-0.75; 5 1.275,0.75; 8 -1.275,0.75 | smd 0.5 x 0.8: 2 -0.4,-0.75; 3 0.4,-0.75; 6 0.4,0.75; 7 -0.4,0.75
SOT95P280X145-5N = smd 1.27 x 0.559: 1 -1.295,0.94; 2 -1.295,0; 3 -1.295,-0.94; 4 1.295,-0.94; 5 1.295,0.94
TSSOP48 = smd 0.32 x 1.2: 1 -5.75,-3.775; 2 -5.25,-3.775; 3 -4.75,-3.775; 4 -4.25,-3.775; 5 -3.75,-3.775; 6 -3.25,-3.775; 7 -2.75,-3.775; 8 -2.25,-3.775; 9 -1.75,-3.775; 10 -1.25,-3.775; 11 -0.75,-3.775; 12 -0.25,-3.775; 13 0.25,-3.775; 14 0.75,-3.775; 15 1.25,-3.775; 16 1.75,-3.775; 17 2.25,-3.775; 18 2.75,-3.775; 19 3.25,-3.775; 20 3.75,-3.775; 21 4.25,-3.775; 22 4.75,-3.775; 23 5.25,-3.775; 24 5.75,-3.775; 25 5.75,3.775; 26 5.25,3.775; 27 4.75,3.775; 28 4.25,3.775; 29 3.75,3.775; 30 3.25,3.775; 31 2.75,3.775; 32 2.25,3.775; 33 1.75,3.775; 34 1.25,3.775; 35 0.75,3.775; 36 0.25,3.775; 37 -0.25,3.775; 38 -0.75,3.775; 39 -1.25,3.775; 40 -1.75,3.775; 41 -2.25,3.775; 42 -2.75,3.775; 43 -3.25,3.775; 44 -3.75,3.775; 45 -4.25,3.775; 46 -4.75,3.775; 47 -5.25,3.775; 48 -5.75,3.775
SO08 = smd 0.6 x 2.2: 1 -1.905,-2.6; 2 -0.635,-2.6; 3 0.635,-2.6; 4 1.905,-2.6; 5 1.905,2.6; 6 0.635,2.6; 7 -0.635,2.6; 8 -1.905,2.6

### Placement (x,y rotation side)
1REL_A  9.99,22.22 0 top
1REL_B  16,8.2 0 top
2REL_A  93,22.2 0 top
2REL_B  89.8,8.2 180 top
ADC1  37.59,11.32 0 top
ADC2  70.8,14.6 180 top
AMP1  27.4,9.8 180 top
AMP2  81,15.6 0 top
AMP3  59.11,23.75 0 bottom
BNC1  7.34,33.36 0 top
BNC2  93.4,33.4 0 top
C1  71.4,28 0 top
C2  82.2,36.4 90 top
C3  84.2,25 0 top
C4  80.8,26.2 90 top
C5  71.8,17.8 90 bottom
C6  36.8,8.4 270 bottom
C7  53.8,19.6 0 bottom
C8  64.4,19.6 0 bottom
C9  75.4,12.2 270 top
C10  32.8,13.6 90 top
C11  61,29 180 bottom
C12  57,29 180 bottom
C13  73.4,11.6 270 bottom
C14  76.4,17.4 270 top
C15  67.8,25.4 270 top
C16  34.4,12.8 270 bottom
C17  31.8,8 90 top
C18  85.8,22.2 270 bottom
C19  79.8,18.2 0 bottom
C20  79.6,20 0 bottom
C21  95.4,16.2 270 top
C22  88.2,16.2 270 top
C23  84,15.4 270 top
C24  80,11.8 0 bottom
C25  80,10 0 bottom
C26  26.4,7.2 0 bottom
C27  26.4,5.6 0 bottom
C28  1.8,15.4 270 top
C29  13.4,16.2 270 top
C30  6.2,16.2 270 top
C31  26.4,9 0 bottom
C32  26.4,10.8 0 bottom
C33  65.8,25.8 90 top
C43  40.8,18 180 top
C44  37.6,17 90 top
C46  76.89,8.24 0 top
C47  39,9.4 270 bottom
C49  34.56,9.1 270 bottom
C50  42.76,26.25 270 bottom
C56  74.87,9.99 0 top
C60  34.36,26.69 270 bottom
C61  69.8,17.4 90 bottom
C63  73.59,17.07 90 bottom
C70  51.8,10.4 0 bottom
C73  3,22 90 bottom
C77  36.81,27.63 270 bottom
CLKBUF  58.4,16.2 270 top
D1  31,13.2 90 top
D2  57.4,17.6 0 bottom
D3  60.2,17.6 180 bottom
D4  93.6,8.2 270 bottom
D5  6.2,22.2 90 bottom
D6  89.2,22.2 90 bottom
D7  77.2,12.2 270 top
D8  12.2,8.2 90 bottom
D9  81.4,10.8 270 top
D10  24,13.2 180 top
D11  77,25.4 90 top
DAC  59.29,10.37 90 bottom
DPOT  25.6,27.4 0 bottom
JP1  62.4,3.8 180 top
JP2  62.4,36.8 180 top
LOGIC_IN  29.2,36.8 0 bottom
LOGIC_SUPPLY_SEL  19.6,23.6 270 top
OFFSET1  26.6,5 270 top
OFFSET2  81.8,20.4 90 top
OSC  62.6,21.4 180 top
R1  71.4,30.8 0 top
R2  83.4,30.8 0 top
R3  54.6,16.6 0 top
R4  78.6,15 90 top
R5  77.8,18 90 top
R6  32.2,11.4 180 top
R7  58.2,10.6 90 top
R8  53.8,26.4 180 bottom
R9  19.4,27.2 0 bottom
R10  85.8,20 90 top
R11  30,10.6 270 top
R12  93.8,21 180 bottom
R13  10.4,20.8 0 bottom
R14  84.2,23.6 0 top
R15  85,8 180 bottom
R16  88.4,10 0 bottom
R17  97.2,13.2 0 top
R18  64.4,26.2 180 bottom
R19  64.4,28.2 0 bottom
R20  64.4,24.8 0 bottom
R21  40.26,9.47 270 bottom
R22  30.4,7.6 270 top
R23  23.2,6.8 90 top
R24  23.2,3.4 90 top
R25  17.8,4.2 90 bottom
R26  22.4,28.2 270 bottom
R27  16.8,6.6 180 bottom
R28  93.6,13.2 0 top
R29  86.8,13.2 0 top
R30  84.2,27.6 0 top
R31  78.2,25.4 90 top
R32  11.4,13.2 0 top
R33  8,13 0 top
R34  4.6,13 0 top
R35  75.6,25.4 90 top
R36  60.8,15.6 90 bottom
R37  59.4,15.6 270 bottom
R38  58,15.6 270 bottom
R39  56.6,15.6 90 bottom
R45  68.4,17.4 90 bottom
R50  76.4,14.4 0 top
R54  51.8,7.6 0 bottom
R55  51.8,9 180 bottom
R56  13.11,23.47 270 bottom
R57  53.8,28.2 180 bottom
R58  96.31,23.79 270 bottom
R59  52.67,21.09 0 bottom
R60  64.4,22.4 0 bottom
R61  65.6,21 180 bottom
R62  53.8,18.2 0 bottom
R63  64.4,18.2 180 bottom
R65  53.8,25 0 bottom
R66  53.89,22.66 180 bottom
RN1  43.8,12.8 270 top
RN2  43.8,9 270 top
RN3  65.4,11.4 180 top
RN4  65.6,17.4 90 top
SUPPLY  19.6,30.4 270 bottom
T1  10.25,23.67 0 bottom
T2  93.88,23.87 0 bottom
T3  88.4,7 180 bottom
T4  16.8,9.6 0 bottom
TXRX  43.2,26.8 270 top
VREG  77.8,31.4 270 top

### Tracks (layer width: path | path; a pad name or v marks a point on that pad's centre or on a via)
1_REL_A
  Bottom 0.305: JP2.1 77.58,39.4 17.2,39.4 15.6,37.8 15.6,32.2 13.11,29.71 R56.1
1_REL_B
  Bottom 0.305: JP1.4 75.04,1.2 18.8,1.2 17.8,2.2 R25.1
2_REL_A
  Bottom 0.406: 78.98,35.6 JP2.2 79.58,36.2 92,36.2 96.31,31.89 R58.1
2_REL_B
  Bottom 0.406: R15.1 81.84,8 JP1.1
3.3V  (via drill 0.5)
  Top 0.254: TXRX.42 45.65,29.55 45.6,29.6 | TXRX.31 45.85,24.05 45.8,24 | 72.4,13.2 71.4,13.2
  Top 0.305: C56.1 73.64,9.96 ADC2.1 | 84.75,20.4 82.2,20.4 | ADC2.4 72.83,12.97 72.4,13.2
  Top 0.406: 73.64,19.48 ADC2.12 | 82.2,20.4 82,20 v82,18.8
  Bottom 0.406: DPOT.1 27.06,28.06 30.8,32 41,32 v41.6,32.4 | R54.2 48.42,7.6 JP1.27 | v68.8,19.6 68.8,18.65 R45.2 | v82,18.8 81.4,18.2 C19.1 C20.1 | C26.1 28.4,7.2 v28.6,7 | DAC.14 63.1,15.5 62.4,16.2 62.4,17.8 v62.2,18
  Bottom 0.61: v42.8,28.6 42.76,28.16 C50.1 | R21.2 40.4,8.48 v40.4,6.6 | C27.1 27.25,5.6 C26.1
  pour Top (isolate 0.254, rank 3): 0.2,40.4 0.2,0.2 100.4,0.4 100.6,40.6
5V  (via drill 0.5)
  Top 0.61: 2REL_A.2 95.86,19.66 96.4,20.2 | 67.7,24.75 C15.2 65.85,24.45 C33.+
  Bottom 0.406: SUPPLY.3 20.54,30.74 20.2,30.4 19,30.4 18.66,30.74 SUPPLY.1 18.66,33.66 v18.8,33.8 | D8.C 12.4,6.92 1REL_B.2 | D6.C 2REL_A.2 | AMP3.4 61.72,23.6 69.2,23.6 70,22.8 v70,22.6
  Bottom 0.61: 2REL_B.2 92.24,10.74 D4.C | D5.C 6.2,20.93 1REL_A.2
  pour Top (isolate 0.254): 1.2,39.8 18.4,39.8 18.4,1.2 1.2,1.2
  pour Top (isolate 0.2): 16.6,40.4 73.6,40.4 73.8,35 73.4,35 73.4,35.4 16.8,35.4
  pour Top (isolate 0.254): 100,39.4 68,39.4 68,23.8 87.6,23.8 87.6,13 83.4,13 83.4,3.6 100,3.6
  pour Top (isolate 0.254): 68,24.4 68,22 70.8,22 70.8,24.4
ADC1_PD  (via drill 0.5)
  Top 0.254: ADC1.23 39.24,14.24 38.8,13.8 38.8,12.4 38.2,11.8 38.2,10.6 38.6,10.2 v38.6,6.6
  Top 0.305: 74.6,1.2 39.6,1.2 38.6,2.2 v38.6,4.4
  Top 0.36: 76.37,4.97 75.2,3.8 75.2,1.8 74.6,1.2
  Top 0.406: 76.37,4.97 JP1.3
  Bottom 0.305: v38.6,4.4 v38.6,6.6
ADC1_VRB  (via drill 0.5)
  Top 0.254: v37,12.6 37,10.2 35.8,9 34.78,9
  Top 0.406: C17.2 32.2,9 34.71,9 ADC1.10 34.78,9
  Bottom 0.406: v37,12.6 38.4,13.4 52.8,13.4 54.65,15.25 R62.1 C7.1 54.99,19.94 AMP3.8
ADC1_VRB_DAC
  Bottom 0.305: AMP3.10 57.92,22.48 58.2,22.2 58.2,19.2 56.8,17.8
  Bottom 0.406: 56.43,22.46 56.45,22.48 AMP3.10 54.92,22.48 R66.2 arc-90 54.68,22.8 | 56.8,17.8 56.8,17.6 D2.A 56.7,16.55 R39.2
ADC1_VRB_DAC_OUT
  Bottom 0.406: DAC.9 56.75,14.4 arc90 R39.1
ADC1_VRT  (via drill 0.5)
  Top 0.406: 35.4,13.6 ADC1.3 35.4,13.61 35.4,13.6 | 35.4,13.6 35.6,13.6 v37.2,14.4 | v44.6,16.4 47.4,16.4 48.2,17.2 v48.2,19
  Bottom 0.406: v48.2,19 48.2,26.4 50,28.2 R57.1 52.95,28.95 53.4,29.4 55.75,29.4 C12.1 56.15,27.56 AMP3.14 | v37.2,14.4 38.8,16.4 v44.6,16.4 | 36.45,13.65 v37.2,14.4 | v37.2,14.4 36.4,13.6 ADC1.3 C16.1
ADC1_VRT_DAC
  Bottom 0.305: AMP3.12 57.98,25.02 58.8,24.2 58.8,18 58.4,17.6
  Bottom 0.406: R38.1 58.2,16.65 58,16.85 D2.C 58.4,17.6 | 56.2,25 56.2,25.02 AMP3.12 56.63,25 R65.1
ADC1_VRT_DAC_OUT
  Bottom 0.406: DAC.10 58.02,14.73 R38.2
ADC2_PD
  Top 0.305: JP1.2 78.87,2.53 77.6,3.8 77.6,5.8 77.2,6.2 74.6,6.2 69.12,11.68 ADC2.23
ADC2_VRB  (via drill 0.5)
  Top 0.406: v70.6,13.4 72.49,16.89 ADC2.10 76.14,16.89 C14.2
  Bottom 0.406: v70.6,13.4 70.2,12.6 65.6,12.6 63.95,14.25 63.95,17.8 R63.1 | C8.2 63.21,19.94 AMP3.7
  Bottom 0.61: C8.2 R63.1
ADC2_VRB_DAC
  Bottom 0.305: AMP3.5 60.28,22.48 60,22.2 60,19.2 60.9,18.3 D3.A
  Bottom 0.406: R36.2 60.8,17.5 D3.A | R60.2 63.47,22.48 AMP3.5
ADC2_VRB_DAC_OUT
  Bottom 0.406: DAC.12 60.56,14.51 R36.1
ADC2_VRT  (via drill 0.5)
  Top 0.406: ADC2.3 72.31,12.31 v72,12.2 | v71.8,23.8 v74.2,21.4
  Bottom 0.406: 73.4,12.6 76.4,15.6 76.4,19.2 v74.2,21.4 | C13.1 arc-90 73.35,12.4 v72,12.2 | AMP3.1 61.85,27.84 C11.2 61.85,29.05 62.6,29.6 64.8,29.6 65.2,29.2 65.2,28.45 R19.1 arc-90 65.65,28.6 69.6,28.6 70.6,27.6 70.6,25 v71.8,23.8
  Bottom 0.61: 73.4,12.6 73.55,12.4 C13.1
ADC2_VRT_DAC
  Bottom 0.305: AMP3.3 60.22,25.02 59.4,24.2 59.4,17.8
  Bottom 0.406: R20.2 63.17,25.02 AMP3.3 | R37.1 59.6,16.65 D3.C 59.4,17.8
ADC2_VRT_DAC_OUT
  Bottom 0.406: DAC.11 59.29,14.64 R37.2
ADCA0
  Top 0.305: RN3.8 66.67,10.53 68.6,8.6 70.6,8.6 73.8,5.4 73.8,5.1 JP1.5
ADCA1
  Top 0.305: JP1.6 73.83,2.57 72.6,3.8 72.6,5.4 70,8 68.4,8 66,10 65.8,10.2 RN3.7 65.8,10.4
ADCA2
  Top 0.305: 65,10.4 RN3.6 65,10.2 65.6,9.6 68,7.6 68.2,7.4 68.96,7.4 JP1.7
ADCA3
  Top 0.305: 64.12,10.47 RN3.5 64.2,10.57 64.2,10.2 65.2,9.2 68.2,6.6 69,6.6 70,5.6 70,3.82 JP1.8
ADCA4
  Top 0.305: RN4.8 64.33,16.12 63.4,15.2 63.4,9.6 65.8,7.2 66.62,7.2 JP1.9
ADCA5
  Top 0.305: RN4.7 64.4,17 62.8,15.4 62.8,9.4 65.6,6.6 66.4,6.6 67.4,5.6 67.4,3.88 JP1.10
ADCA6
  Top 0.305: RN4.6 64.4,17.8 62.2,15.6 62.2,9.08 JP1.11
ADCA7
  Top 0.305: RN4.5 64.4,18.68 61.6,15.88 61.6,8.8 65,5.4 65,3.74 JP1.12
ADCB0
  Top 0.305: JP1.18 57.4,3.72 57.4,6.2 49.52,14.07 RN1.8
ADCB1
  Top 0.305: JP1.19 56.05,6.35 49.2,13.2 RN1.7
ADCB2
  Top 0.305: JP1.20 54.8,3.78 54.8,6.2 48.6,12.4 RN1.6
ADCB3
  Top 0.305: JP1.21 53.51,6.49 48.48,11.53 RN1.5
ADCB4
  Top 0.305: JP1.22 52.2,3.84 52.2,6 47.92,10.28 RN2.8
ADCB5
  Top 0.305: JP1.23 51,5.1 51,6.2 47.8,9.4 RN2.7
ADCB6
  Top 0.305: JP1.24 49.6,3.9 49.6,5.8 46.8,8.6 RN2.6
ADCB7
  Top 0.305: JP1.26 47.2,3.76 47.2,5.8 45.26,7.74 45.25,7.72 RN2.5
CLK1
  Top 0.406: CLKBUF.5 53.87,13.28 52.25,14.9 ADC1.24
CLK2  (via drill 0.5)
  Top 0.305: ADC2.24 68.56,11.02 68.6,10.97
  Top 0.406: v59.6,10 59.6,12.2 59.37,12.63 CLKBUF.8 | v68.6,10 68.6,10.97
  Bottom 0.406: v59.6,10 v68.6,10
CLK_FPGA
  Top 0.406: JP1.15 61,5.2 61,5.6 58.8,7.8 58.8,9.35 R7.1
DACB0
  Bottom 0.406: JP1.17 57.73,5.07 56.4,6.4 55.8,6.4 55.48,6.72 DAC.7
DACB1
  Bottom 0.406: DAC.6 56.75,7.05 57.4,6.4 62.34,6.4 JP1.13
DACB2  (via drill 0.5)
  Top 0.406: JP1.16 59.8,3.86 59.8,5.8 55.6,10 v55.6,10.8
  Bottom 0.406: v55.6,10.8 55.48,10.92 DAC.8
DACB3  (via drill 0.5)
  Top 0.406: v60.6,11 60.6,7.4 62.4,5.6 62.4,3.8 JP1.14
  Bottom 0.406: DAC.13 61.83,11.43 61.4,11 v60.6,11
DACTR0  (via drill 0.5)
  Top 0.305: v72.4,33.8 72.6,34 72.6,36.2 73.2,36.8 75.1,36.8 JP2.3
  Bottom 0.305: v72.4,33.8 72,33.4 70.6,33.4 70,32.8 50,32.8 47.8,30.6 33,30.6 29.14,26.74 DPOT.3
DACTR1  (via drill 0.5)
  Top 0.305: JP2.4 76.13,35.53 74.8,34.2 73.8,34.2 73.4,33.8 73.4,33.16 72.64,32.4 v71.2,32.4
  Bottom 0.305: DPOT.4 24.71,26.09 25,25.8 29.6,25.8 33.8,30 48.2,30 50.4,32.2 71,32.2 v71.2,32.4
EXT_SUPPLY
  Bottom 0.406: LOGIC_IN.17 17.13,33.62 17.13,26.27 18.33,25.07 LOGIC_SUPPLY_SEL.1
GND  (via drill 0.5)
  Top 0.254: TXRX.39 45.75,28.05 v45.2,28.6 | TXRX.45 45.35,31.05 v45,31.6 | TXRX.34 45.45,25.55 v44.6,26.4 | TXRX.28 45.65,22.55 v45.2,23 | TXRX.10 40.35,28.05 40.8,27.6 v40.8,26.8 40.8,26 40.35,25.55 TXRX.15 | v40.8,23 40.35,22.55 TXRX.21 | TXRX.4 42.45,31.05 v43,31.6
  Top 0.305: v75.2,18.2 74.52,17.52 ADC2.11 | 72.88,11.68 ADC2.2 72.68,11.68 v72.2,11 | v42,10.8 41.55,10.36 ADC1.17 | ADC1.5 35.31,12.29 36.2,12 v36.2,11.4 36.2,11 | 36.2,11 35.6,10.4 34.59,10.4 ADC1.8 | ADC1.7 35.59,10.99 36.2,11 | v36.2,15.4 36.2,14.8 35.44,14.24 ADC1.2 | ADC2.8 72.97,15.56 72.33,14.93 | ADC2.5 72.97,13.63 v72.2,14 72.2,14.8 72.33,14.93 | ADC2.7 72.33,14.93 | ADC1.11 33.4,8.4 v33,8 | ADC1.2 34.74,14.25 | 32.8,14.25 32.8,14.24 ADC1.2 | v56.2,18.6 57.44,18.6 CLKBUF.4 | ADC2.17 67.4,15.6 v65.4,15
  Top 0.406: 61.35,22.35 OSC.2 61.2,22.4 | C14.1 75.75,18.2 v75.2,18.2 | D1.A 31.35,14.25 32.8,14.25 C10.2 | ADC2.2 75.4,11.68 C9.2 77.2,11.35 D7.A | C17.1 32.15,7.15 v33,8 | C46.- 78.59,8.01
  Top 0.61: C4.+ 80.9,24.45 78.2,24.45 R31.1 | R31.1 v78.2,23.2 | C23.2 85.35,13.2 R29.1 85.6,13.25 v85.6,14.6 | C28.2 1.8,13.4 v2.2,13 R34.1 | R31.1 78.15,24.6 77,24.6 D11.C | VREG.3 75.23,30.8 v77.6,30.8 | 67.7,26.45 C15.1 v67.8,27.6 66.3,27.6 C33.- 61.55,22.85 OSC.2 | C2.- 82.3,37.6 v84.4,37.6 | C56.2 v77.21,9.99 | v77.21,9.99 78.2,9 C46.- | v77.2,10 v77.21,9.99 | C43.- 37.75,18 C44.2 v37.6,19.2
  Bottom 0.305: v36.2,15.4 36.65,15.4
  Bottom 0.406: v37.6,19.2 37.4,19.8 | AMP3.11 56.5,23.8 | 53,23.8 52.95,23.65 R65.2
  pour Bottom (isolate 0.254, rank 3): 0.4,39.6 99.6,39.6 99.8,0.6 0.4,0.4
HF_IN
  Top 0.61: C29.1 16.55,16.4 | R32.2 13.4,13.2 16,15.8 16,15.95 C29.1 | 1REL_A.6 1REL_A.5 15.07,16.2 C29.1
HF_IN1
  Top 0.61: 2REL_A.6 2REL_A.5 98.08,16.32 C21.1 97.85,16.1 97.85,13.3 R17.2
LOGIC_SUPPLY  (via drill 0.5)
  Top 0.254: TXRX.7 40.45,29.55 v41,29 41.6,28.4 41.6,24.4 41.25,24.05 TXRX.18
  Bottom 0.254: v41,29 40.58,28.58 C77.1
  Bottom 0.406: 34.22,28.4 33.6,28.4 29.4,24.2 20.87,24.2 | C60.+ 34.4,28.58 C77.1 | LOGIC_SUPPLY_SEL.4 20.87,24.2 | 20.87,24.2 LOGIC_SUPPLY_SEL.2
  Bottom 0.61: 34.22,28.4 C60.+
N$2
  Top 0.61: R1.2 74.08,32.03 VREG.2
N$3
  Top 0.406: R22.2 30.4,6.2 29.2,5 OFFSET1.2
N$4
  Top 0.305: R3.2 58,16.6 58.73,17.33 CLKBUF.2
N$5
  Top 0.61: C1.- arc-90 72.94,28.3 74.14,29.5 VREG.4
N$6
  Top 0.305: OSC.3 59.65,20.25 59.4,20 59.4,19.16 CLKBUF.1
N$7
  Bottom 0.61: C18.2 86.8,20.78 2REL_A.1
N$8
  Top 0.406: AMP2.1 80.05,14.15 R4.1 78.95,14.2 78.95,14.4 R50.2 | 77.65,14.2 R50.2 | D7.C 77.2,14.4 R50.2
N$9
  Top 0.61: R1.1 69.95,29.6 C1.+
N$10
  Top 0.406: R7.2 58.73,11.92 CLKBUF.7
N$11
  Top 0.406: 24.8,5.95 OFFSET1.1
  Top 0.61: R23.1 24.75,5.95 OFFSET1.1
N$12
  Top 0.406: OFFSET1.3 24.6,4.05
  Top 0.61: R24.2 24.55,4.25 OFFSET1.3
N$13
  Top 0.406: D1.C 31,11.8 R6.2 30,11.4 R11.1 28.49,11.45 28.49,11.25 AMP1.1
N$14
  Top 0.406: AMP1.4 26.45,9.25 27,9.8 29.75,9.8 R11.2 30,8.85 R22.1
N$15
  Bottom 0.406: SUPPLY.4 20.54,29.34 | R9.1 20.54,27.49 SUPPLY.4 | SUPPLY.4 20.54,29.05 R26.1
N$16
  Bottom 0.406: DPOT.5 22.45,27.4 R26.2
N$17
  Bottom 0.406: SUPPLY.5 18.55,28.99 R9.2 18.4,27.05 18.4,27 19.6,25.8 19.6,23.6 LOGIC_SUPPLY_SEL.3
N$18
  Bottom 0.406: AMP3.9 53.64,21.21 R59.1 52.95,20.52 C7.2 R62.2
  Bottom 0.61: 56.64,21.2 AMP3.9
N$19
  Bottom 0.406: T3.1 87.35,8 R15.2
  Bottom 0.61: R16.2 87.45,9.7 T3.1
N$20
  Top 0.61: R5.2 78.75,18.85 OFFSET2.2
N$21
  Top 0.406: AMP2.4 81.95,16.15 81.4,15.6 78.85,15.6 R4.2
  Top 0.61: R5.1 77.8,16.65 R4.2
N$22
  Top 0.406: 85.7,19.25 R10.1 85.55,19.4 OFFSET2.1
N$23  (via drill 0.5)
  Top 0.406: ADC1.9 33.31,9.69 v33,10
  Bottom 0.406: C49.1 33.05,9.95 v33,10
N$24
  Top 0.406: R6.1 32.9,11.65 | 32.9,11.65 ADC1.6 | C10.1 32.8,11.75 32.9,11.65
N$25
  Top 0.406: OFFSET2.3 85.05,22.8 R14.2
N$26
  Bottom 0.406: C12.2 58.2,28.65 58.2,26.6 57.89,26.29 AMP3.13 54.76,26.29 R8.2 R57.2
N$27
  Top 0.406: 95.95,13.05 R17.1 96.2,12.95 96.2,6.98 2REL_B.10
  Top 0.61: R17.1 R28.2 94.45,13.3 94.45,15.25 C21.2 C22.1
N$28  (via drill 0.5)
  Top 0.305: ADC1.18 39.41,10.99 v39,11.4
  Bottom 0.305: 37.4,10.45 37.6,10.25 | R21.1 38.88,10.32 38.8,10.4 39,10.6
  Bottom 0.406: 39,10.6 v39,11.4
  Bottom 0.61: C6.+ 37.6,10.25 C47.1 39.99,10.25 R21.1
N$29
  Top 0.406: 1REL_B.10 10.65,11.81 10.65,13
  Top 0.61: C30.1 9.6,16 | 9.6,16 C29.2 | 9.6,16 9.45,15.85 9.8,15.85 9.8,13.2 10,13 | R33.2 10,13 | 10,13 10.65,13 R32.1
N$32
  Top 0.406: 24,11.11 AMP1.3 | 1REL_B.5 1REL_B.6 21.45,11.11 24,11.11 | D10.3 24,11.11
N$33
  Bottom 0.406: T4.3 13.9,10.7 1REL_B.9 12.2,9.48 D8.A
N$34
  Bottom 0.406: T4.1 17.75,6.7 R27.2 17.65,5.2 R25.2
N$39
  Bottom 0.61: 1REL_A.1 4.91,19.66 C73.1
N$41
  Top 0.61: 2REL_B.6 2REL_B.5 | D9.3 82.44,10.74 2REL_B.5 | 2REL_B.5 84.72,11.92 AMP2.3
N$42
  Top 0.61: R2.1 82.28,30.77 VREG.6
N$43
  Bottom 0.61: T3.3 89.04,5.66 2REL_B.9 92.24,5.66 D4.A
N$44
  Top 0.61: C3.1 R30.1 83.1,27.65 C4.- | VREG.5 80.4,28.05 arc90 C4.- | 77,26.25 R31.2 79.6,27.65 C4.- | D11.A 77,26.25 | 77,26.25 R35.2
N$46
  Top 0.406: R28.1 93.15,12.47 2REL_B.1
  Top 0.61: C23.1 84.2,16.2 C22.2 86.2,16.2 87.4,15 87.4,13.25 R29.2 R28.1
N$47  (via drill 0.5)
  Top 0.61: C3.2 R30.2 85.05,30 R2.2 84.85,31.4 v85.4,31.4 | v77.6,33.2 77.3,33.3 VREG.1
  Bottom 0.61: v85.4,31.4 79.4,31.4 v77.6,33.2
N$49
  Top 0.406: 1REL_B.1 10.92,6.28 7.8,9.6 7.8,11.95 R33.1
  Top 0.61: C28.1 3.8,16.25 C30.2 4.25,15.8 4.6,15.8 5.55,14.85 R34.2 R33.1
N$51
  Top 0.305: ADC1.22 41.61,13.61 42.2,14 42.98,14 RN1.1
N$52
  Top 0.305: ADC1.21 41.95,12.95 42.4,13.2 RN1.2
N$53
  Top 0.305: ADC1.20 42.28,12.29 42.6,12.4 RN1.3
N$54  (via drill 0.5)
  Top 0.305: v75,16 74.77,16.23 ADC2.9
  Bottom 0.305: C63.1 74.78,16.22 v75,16
N$55
  Top 0.406: R50.1 75.88,14.27 ADC2.6 | R50.1 75.4,13.65 | C9.1 75.4,14.2 R50.1
N$56  (via drill 0.5)
  Top 0.305: ADC2.18 69.13,14.93 v69.4,15.2
  Bottom 0.305: v69.4,15.2 69.8,15.6 C61.1
  Bottom 0.406: C5.+ C61.1 R45.1
N$57
  Top 0.305: ADC1.19 42.98,11.65 RN1.4
N$58
  Top 0.305: ADC1.16 41.89,9.69 42.6,10.2 42.98,10.2 RN2.1
N$59
  Top 0.305: ADC1.15 42.03,9.03 42.6,9.4 RN2.2
N$60
  Top 0.305: ADC1.14 42.4,8.4 42.6,8.6 RN2.3
N$61
  Top 0.305: ADC1.13 43.04,7.74 RN2.4
N$62
  Top 0.305: ADC2.22 66.91,12.31 66.75,12.15 RN3.1
N$63
  Top 0.305: RN3.2 65.8,12.6 66.2,13 67.93,13 ADC2.21
N$64
  Bottom 0.406: DAC.2 DAC.3 DAC.4 DAC.5 58.02,8.98 57.6,9.4 52.85,9.4 arc-90 52.65,9.6 | 52.65,9.6 C70.1 arc90 52.85,10.2 | 52.65,9.6 R55.2 R54.1
N$65
  Top 0.305: RN3.3 65,12.6 66,13.6 67.92,13.6 ADC2.20
N$66
  Top 0.305: RN3.4 64.2,12.22 64.2,12.6 65.8,14.2 66.8,14.2 67.07,14.27 ADC2.19 68.13,14.27
N$67
  Bottom 0.406: C11.1 60,28.85 60,26.6 60.31,26.29 AMP3.2 63.55,26.29 R18.1 R19.2
N$69
  Top 0.305: ADC2.16 66.65,16.23 RN4.1
N$72
  Top 0.305: ADC2.15 67.06,16.89 RN4.2
N$73
  Top 0.61: 4.91,24.91 1REL_A.10 5.35,25.2 5.4,25.2 5.4,26.34 BNC1.1
  Bottom 0.61: C73.2 3.6,23.47 1REL_A.10
N$75
  Bottom 0.406: AMP3.6 64.54,21.21 R61.1 64.75,20.1 C8.1
  Bottom 0.61: R63.2 C8.1
N$76
  Top 0.305: ADC2.14 67.28,17.52 66.8,17.8 RN4.3
N$77
  Top 0.305: 67.82,18.18 ADC2.13 67.94,18.2 67.2,18.2 66.6,18.8 66.47,18.8 RN4.4
N$78
  Bottom 0.61: 10.28,24.8 T1.3 1REL_A.9 6.2,23.51 D5.A
N$80
  Bottom 0.61: R56.2 12.24,22.57 T1.1 11.2,20.95 R13.1
N$81
  Top 0.61: BNC2.1 93.32,28.32 92,27 90,27 88.12,25.12 2REL_A.10
  Bottom 0.61: 87.72,24.64 2REL_A.10 86.8,23.62 C18.1
N$84
  Bottom 0.305: 93.85,24.76 arc90 T2.3 arc90 93.97,25.06
  Bottom 0.406: 2REL_A.9 90.46,24.6 D6.A
  Bottom 0.61: 93.85,24.76 2REL_A.9 | 93.97,24.97 T2.3
N$85
  Bottom 0.61: R58.2 95.76,22.77 T2.1 94.65,22.59 R12.2
TR0
  Top 0.254: TXRX.25 56.81,21.05 JP2.8
TR1
  Top 0.254: TXRX.26 56.55,21.55 70,35 70,36.78 JP2.7
TR2
  Top 0.254: TXRX.27 56.05,22.05 68.75,34.75 JP2.10
TR3
  Top 0.254: TXRX.29 55.45,23.05 67.4,35 67.4,36.72 JP2.9
TR4
  Top 0.254: TXRX.30 54.95,23.55 66.21,34.81 JP2.12
TR5
  Top 0.254: TXRX.32 54.75,24.55 65,34.8 65,36.86 JP2.11
TR6
  Top 0.254: TXRX.33 53.85,25.05 63.67,34.87 JP2.14
TR7
  Top 0.254: TXRX.35 53.65,26.05 62.4,34.8 62.4,36.8 JP2.13
TR8
  Top 0.254: TXRX.36 52.95,26.55 61.13,34.73 JP2.16
TR9
  Top 0.254: TXRX.37 52.05,27.05 59.8,34.8 59.8,36.74 JP2.15
TR10
  Top 0.254: TXRX.38 51.55,27.55 58.59,34.59 JP2.18
TR11
  Top 0.254: TXRX.40 50.95,28.55 57.2,34.8 57.2,36.68 JP2.17
TR12
  Top 0.254: TXRX.41 50.65,29.05 56.05,34.45 JP2.20
TR13
  Top 0.254: TXRX.43 50.05,30.05 54.8,34.8 54.8,36.82 JP2.19
TR14
  Top 0.254: TXRX.44 49.55,30.55 53.51,34.51 JP2.22
TR15
  Top 0.254: TXRX.46 48.95,31.55 52.2,34.8 52.2,36.76 JP2.21
TR16
  Top 0.254: TXRX.47 48.25,32.05 50.97,34.77 JP2.24
TR17
  Top 0.254: TXRX.48 47.35,32.55 49.6,34.8 49.6,36.7 JP2.23
TR18  (via drill 0.5)
  Top 0.254: v41,21.4 40.65,21.05 TXRX.24
  Bottom 0.254: JP2.6 73.83,33.73 71.3,31.2 50.8,31.2 v41,21.4
TR19  (via drill 0.5)
  Top 0.254: TXRX.1 39.4,32.58 v39.4,33.6
  Bottom 0.254: v39.4,33.6 39.8,34 71.4,34 72.6,35.2 72.6,36.84 JP2.5
TRIN0
  Top 0.254: TXRX.2 40.25,32.05 40.6,32.4 40.6,34.29 LOGIC_IN.1
TRIN1
  Top 0.254: TXRX.3 38.45,31.55 38,32 38,36.71 LOGIC_IN.2
TRIN2
  Top 0.254: TXRX.5 38.65,30.55 36.8,32.4 36.8,35.51 LOGIC_IN.3
TRIN3
  Top 0.254: TXRX.6 38.35,30.05 35.6,32.8 35.6,36.85 LOGIC_IN.4
TRIN4
  Top 0.254: TXRX.8 38.55,29.05 34.28,33.32 LOGIC_IN.5
TRIN5
  Top 0.254: TXRX.9 38.25,28.55 33,33.8 33,36.79 LOGIC_IN.6
TRIN6
  Top 0.254: TXRX.11 38.45,27.55 31.74,34.26 LOGIC_IN.7
TRIN7
  Top 0.254: TXRX.12 38.15,27.05 30.4,34.8 30.4,36.73 LOGIC_IN.8
TRIN8
  Top 0.254: TXRX.13 37.25,26.55 29.2,34.6 LOGIC_IN.9
TRIN9
  Top 0.254: TXRX.14 36.75,26.05 28,34.8 28,36.87 LOGIC_IN.10
TRIN10
  Top 0.254: TXRX.16 35.95,25.05 26.66,34.34 LOGIC_IN.11
TRIN11
  Top 0.254: TXRX.17 35.45,24.55 25.4,34.6 25.4,36.81 LOGIC_IN.12
TRIN12
  Top 0.254: TXRX.19 34.85,23.55 24.12,34.28 LOGIC_IN.13
TRIN13
  Top 0.254: TXRX.20 34.35,23.05 22.8,34.6 22.8,36.75 LOGIC_IN.14
TRIN14
  Top 0.254: TXRX.22 34.35,22.05 21.58,34.82 LOGIC_IN.15
TRIN15
  Top 0.254: TXRX.23 33.65,21.55 20.4,34.8 20.4,36.89 LOGIC_IN.16
V-  (via drill 0.5)
  Top 0.406: AMP2.2 v81,13 81,12.6 80.15,11.75 | AMP1.2 v27.4,12.4 25.5,14.3 D10.1 | R24.1 28.75,2.55 v30,3.8
  Top 0.61: R14.1 82.55,22.85 81.05,22.85 v80.8,22.8 | 80.15,11.75 D9.1 | v74.4,24.6 74.25,24.55 R35.1
  Bottom 0.305: 80.4,8 80.2,8
  Bottom 0.406: 77.6,4 77.6,6 79.2,7.6 80.4,7.6 80.4,8 80.6,8.2 80.6,8.6 | 80.2,8 79.2,8 77.6,6.4 76,6.4 75.2,5.6 75.2,4
  pour Bottom (isolate 0.254, rank 2): 29.2,4 29.2,3.2 82.4,3.2 82.4,4
  pour Bottom (isolate 0.254): 83.2,21.4 83.2,4 80.4,4.4 80.4,21.4
  pour Bottom (isolate 0.254): 74.2,25.6 83.2,25.6 83.2,19.4 80.4,19.2 80.4,24 74.2,24
  pour Bottom (isolate 0.254): 81.2,4.4 82.2,5.4 84,5.4 84,3.2 81.2,3.2
  pour Bottom (isolate 0.254): 30.4,3.4 26.8,3.4 26.8,12.8 30.4,12.8

### Text on the board
tNames: GND | 1 | VCC | EXT | INT